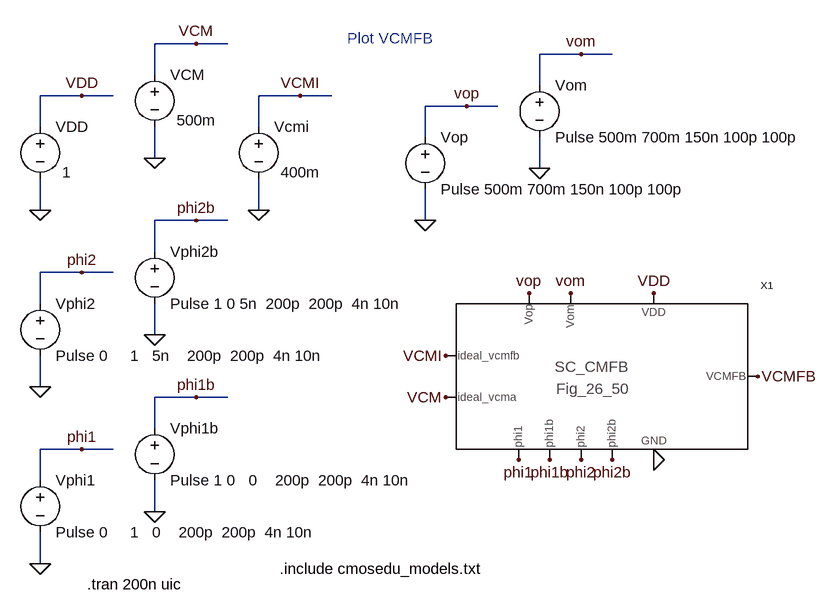
[diagram p0: schematic Fig26_51.asc]
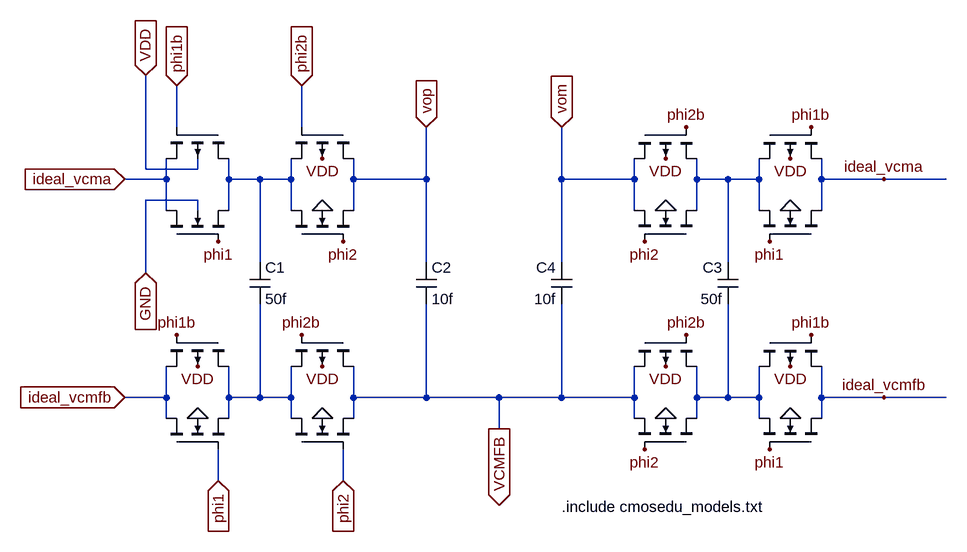
[diagram p1: sub-circuit fig_26_50.asc]
Fig26_51.asc, the LTspice schematic file:
Version 4
SHEET 1 3228 1244
WIRE 1424 -112 1360 -112
WIRE 1472 -112 1424 -112
WIRE 2016 -96 1952 -96
WIRE 2064 -96 2016 -96
WIRE 1360 -64 1360 -112
WIRE 1952 -48 1952 -96
WIRE 1248 -32 1184 -32
WIRE 1296 -32 1248 -32
WIRE 1584 -32 1520 -32
WIRE 1632 -32 1584 -32
WIRE 1840 -16 1776 -16
WIRE 1888 -16 1840 -16
WIRE 1184 16 1184 -32
WIRE 1520 16 1520 -32
WIRE 1776 32 1776 -16
WIRE 1360 64 1360 16
WIRE 1952 80 1952 32
WIRE 1184 144 1184 96
WIRE 1520 144 1520 96
WIRE 1424 160 1360 160
WIRE 1472 160 1424 160
WIRE 1776 160 1776 112
WIRE 1360 208 1360 160
WIRE 1248 240 1184 240
WIRE 1296 240 1248 240
WIRE 1184 288 1184 240
WIRE 1360 336 1360 288
WIRE 1184 416 1184 368
WIRE 1424 432 1360 432
WIRE 1472 432 1424 432
WIRE 1360 480 1360 432
WIRE 1248 512 1184 512
WIRE 1296 512 1248 512
WIRE 1184 560 1184 512
WIRE 1360 608 1360 560
WIRE 1184 688 1184 640
FLAG 1184 688 0
FLAG 1248 512 phi1
FLAG 1360 608 0
FLAG 1424 432 phi1b
FLAG 1184 416 0
FLAG 1248 240 phi2
FLAG 1360 336 0
FLAG 1424 160 phi2b
FLAG 2128 528 0
FLAG 1184 144 0
FLAG 1248 -32 VDD
FLAG 2128 272 VDD
FLAG 2288 400 VCMFB
FLAG 1920 528 phi1
FLAG 1968 528 phi1b
FLAG 2016 528 phi2
FLAG 2064 528 phi2b
FLAG 1360 64 0
FLAG 1424 -112 VCM
FLAG 1808 432 VCM
FLAG 1520 144 0
FLAG 1584 -32 VCMI
FLAG 1808 368 VCMI
FLAG 1776 160 0
FLAG 1840 -16 vop
FLAG 1952 80 0
FLAG 2016 -96 vom
FLAG 1936 272 vop
FLAG 2000 272 vom
SYMBOL voltage 1184 544 R0
SYMATTR InstName Vphi1
SYMATTR Value Pulse 0 	1   0    200p  200p  4n 10n
SYMBOL voltage 1360 464 R0
SYMATTR InstName Vphi1b
SYMATTR Value Pulse 1 0   0    200p  200p  4n 10n
SYMBOL voltage 1184 272 R0
SYMATTR InstName Vphi2
SYMATTR Value Pulse 0 	1   5n    200p  200p  4n 10n
SYMBOL voltage 1360 192 R0
SYMATTR InstName Vphi2b
SYMATTR Value Pulse 1 0 5n  200p  200p  4n 10n
SYMBOL Fig_26_50 1856 480 R0
SYMATTR InstName X1
SYMBOL voltage 1184 0 R0
WINDOW 3 34 86 Left 0
WINDOW 123 0 0 Left 0
WINDOW 39 0 0 Left 0
SYMATTR Value 1
SYMATTR InstName VDD
SYMBOL voltage 1360 -80 R0
WINDOW 3 34 86 Left 0
WINDOW 123 0 0 Left 0
WINDOW 39 0 0 Left 0
SYMATTR Value 500m
SYMATTR InstName VCM
SYMBOL voltage 1520 0 R0
WINDOW 3 34 86 Left 0
WINDOW 123 0 0 Left 0
WINDOW 39 0 0 Left 0
SYMATTR Value 400m
SYMATTR InstName Vcmi
SYMBOL voltage 1776 16 R0
SYMATTR InstName Vop
SYMATTR Value Pulse 500m 700m 150n 100p 100p
SYMBOL voltage 1952 -64 R0
SYMATTR InstName Vom
SYMATTR Value Pulse 500m 700m 150n 100p 100p
TEXT 1256 720 Left 0 !.tran 200n uic
TEXT 1552 696 Left 0 !.include cmosedu_models.txt
TEXT 1656 -120 Left 0 ;Plot VCMFB

fig_26_50.asc, the sub-circuit schematic file:
Version 4
SHEET 1 1620 680
WIRE 432 -304 432 -368
WIRE 624 -304 624 -368
WIRE 384 -240 384 -384
WIRE 464 -240 464 -256
WIRE 464 -240 384 -240
WIRE 416 -224 416 -256
WIRE 416 -224 352 -224
WIRE 512 -224 512 -256
WIRE 560 -224 512 -224
WIRE 608 -224 608 -256
WIRE 608 -224 560 -224
WIRE 704 -224 704 -256
WIRE 816 -224 816 -304
WIRE 816 -224 704 -224
WIRE 1024 -224 1024 -304
WIRE 1136 -224 1136 -256
WIRE 1136 -224 1024 -224
WIRE 1232 -224 1232 -256
WIRE 1280 -224 1232 -224
WIRE 1328 -224 1328 -256
WIRE 1328 -224 1280 -224
WIRE 1424 -224 1424 -256
WIRE 1520 -224 1424 -224
WIRE 1616 -224 1520 -224
WIRE 464 -192 384 -192
WIRE 416 -176 416 -224
WIRE 464 -176 464 -192
WIRE 512 -176 512 -224
WIRE 608 -176 608 -224
WIRE 704 -176 704 -224
WIRE 1136 -176 1136 -224
WIRE 1232 -176 1232 -224
WIRE 1328 -176 1328 -224
WIRE 1424 -176 1424 -224
WIRE 560 -96 560 -224
WIRE 816 -96 816 -224
WIRE 1024 -96 1024 -224
WIRE 1280 -96 1280 -224
WIRE 384 -80 384 -192
WIRE 416 112 416 64
WIRE 416 112 352 112
WIRE 512 112 512 64
WIRE 560 112 560 -32
WIRE 560 112 512 112
WIRE 608 112 608 64
WIRE 608 112 560 112
WIRE 704 112 704 64
WIRE 816 112 816 -32
WIRE 816 112 704 112
WIRE 928 112 816 112
WIRE 1024 112 1024 -32
WIRE 1024 112 928 112
WIRE 1136 112 1136 64
WIRE 1136 112 1024 112
WIRE 1232 112 1232 64
WIRE 1280 112 1280 -32
WIRE 1280 112 1232 112
WIRE 1328 112 1328 64
WIRE 1328 112 1280 112
WIRE 1424 112 1424 64
WIRE 1520 112 1424 112
WIRE 1616 112 1520 112
WIRE 416 144 416 112
WIRE 512 144 512 112
WIRE 608 144 608 112
WIRE 704 144 704 112
WIRE 1136 144 1136 112
WIRE 1232 144 1232 112
WIRE 1328 144 1328 112
WIRE 1424 144 1424 112
WIRE 928 160 928 112
WIRE 496 240 496 192
WIRE 688 240 688 192
FLAG 496 -128 phi1
FLAG 656 -256 VDD
FLAG 656 -176 0
FLAG 688 -128 phi2
FLAG 464 64 VDD
FLAG 464 144 0
FLAG 432 16 phi1b
FLAG 656 64 VDD
FLAG 656 144 0
FLAG 624 16 phi2b
FLAG 1376 -256 VDD
FLAG 1376 -176 0
FLAG 1344 -128 phi1
FLAG 1408 -304 phi1b
FLAG 1184 -256 VDD
FLAG 1184 -176 0
FLAG 1152 -128 phi2
FLAG 1216 -304 phi2b
FLAG 1376 64 VDD
FLAG 1376 144 0
FLAG 1344 192 phi1
FLAG 1408 16 phi1b
FLAG 1184 64 VDD
FLAG 1184 144 0
FLAG 1152 192 phi2
FLAG 1216 16 phi2b
FLAG 1520 -224 ideal_vcma
FLAG 1520 112 ideal_vcmfb
FLAG 352 -224 ideal_vcma
IOPIN 352 -224 In
FLAG 352 112 ideal_vcmfb
IOPIN 352 112 In
FLAG 384 -384 VDD
IOPIN 384 -384 In
FLAG 384 -80 GND
IOPIN 384 -80 In
FLAG 928 160 VCMFB
IOPIN 928 160 Out
FLAG 816 -304 vop
IOPIN 816 -304 In
FLAG 1024 -304 vom
IOPIN 1024 -304 In
FLAG 432 -368 phi1b
IOPIN 432 -368 In
FLAG 496 240 phi1
IOPIN 496 240 In
FLAG 624 -368 phi2b
IOPIN 624 -368 In
FLAG 688 240 phi2
IOPIN 688 240 In
SYMBOL nmos4 416 -128 R270
WINDOW 0 119 20 Invisible 0
WINDOW 3 157 46 Invisible 0
SYMATTR InstName M1
SYMATTR Value N_50n
SYMATTR Value2 l=50n w=500n
SYMBOL pmos4 512 -304 R90
WINDOW 0 116 21 Invisible 0
WINDOW 3 175 48 Invisible 0
SYMATTR InstName M2
SYMATTR Value P_50n
SYMATTR Value2 l=50n w=500n
SYMBOL nmos4 608 -128 R270
WINDOW 0 119 20 Invisible 0
WINDOW 3 157 46 Invisible 0
SYMATTR InstName M3
SYMATTR Value N_50n
SYMATTR Value2 l=50n w=500n
SYMBOL pmos4 704 -304 R90
WINDOW 0 116 21 Invisible 0
WINDOW 3 175 48 Invisible 0
SYMATTR InstName M4
SYMATTR Value P_50n
SYMATTR Value2 l=50n w=500n
SYMBOL nmos4 416 192 R270
WINDOW 0 119 20 Invisible 0
WINDOW 3 157 46 Invisible 0
SYMATTR InstName M5
SYMATTR Value N_50n
SYMATTR Value2 l=50n w=500n
SYMBOL pmos4 512 16 R90
WINDOW 0 116 21 Invisible 0
WINDOW 3 175 48 Invisible 0
SYMATTR InstName M6
SYMATTR Value P_50n
SYMATTR Value2 l=50n w=500n
SYMBOL nmos4 608 192 R270
WINDOW 0 119 20 Invisible 0
WINDOW 3 157 46 Invisible 0
SYMATTR InstName M7
SYMATTR Value N_50n
SYMATTR Value2 l=50n w=500n
SYMBOL pmos4 704 16 R90
WINDOW 0 116 21 Invisible 0
WINDOW 3 175 48 Invisible 0
SYMATTR InstName M8
SYMATTR Value P_50n
SYMATTR Value2 l=50n w=500n
SYMBOL cap 544 -96 R0
SYMATTR InstName C1
SYMATTR Value 50f
SYMBOL cap 800 -96 R0
SYMATTR InstName C2
SYMATTR Value 10f
SYMBOL nmos4 1424 -128 M270
WINDOW 0 119 20 Invisible 0
WINDOW 3 157 46 Invisible 0
SYMATTR InstName M9
SYMATTR Value N_50n
SYMATTR Value2 l=50n w=500n
SYMBOL pmos4 1328 -304 M90
WINDOW 0 116 21 Invisible 0
WINDOW 3 175 48 Invisible 0
SYMATTR InstName M10
SYMATTR Value P_50n
SYMATTR Value2 l=50n w=500n
SYMBOL nmos4 1232 -128 M270
WINDOW 0 119 20 Invisible 0
WINDOW 3 157 46 Invisible 0
SYMATTR InstName M11
SYMATTR Value N_50n
SYMATTR Value2 l=50n w=500n
SYMBOL pmos4 1136 -304 M90
WINDOW 0 116 21 Invisible 0
WINDOW 3 175 48 Invisible 0
SYMATTR InstName M12
SYMATTR Value P_50n
SYMATTR Value2 l=50n w=500n
SYMBOL nmos4 1424 192 M270
WINDOW 0 119 20 Invisible 0
WINDOW 3 157 46 Invisible 0
SYMATTR InstName M13
SYMATTR Value N_50n
SYMATTR Value2 l=50n w=500n
SYMBOL pmos4 1328 16 M90
WINDOW 0 116 21 Invisible 0
WINDOW 3 175 48 Invisible 0
SYMATTR InstName M14
SYMATTR Value P_50n
SYMATTR Value2 l=50n w=500n
SYMBOL nmos4 1232 192 M270
WINDOW 0 119 20 Invisible 0
WINDOW 3 157 46 Invisible 0
SYMATTR InstName M15
SYMATTR Value N_50n
SYMATTR Value2 l=50n w=500n
SYMBOL pmos4 1136 16 M90
WINDOW 0 116 21 Invisible 0
WINDOW 3 175 48 Invisible 0
SYMATTR InstName M16
SYMATTR Value P_50n
SYMATTR Value2 l=50n w=500n
SYMBOL cap 1296 -96 M0
SYMATTR InstName C3
SYMATTR Value 50f
SYMBOL cap 1040 -96 M0
SYMATTR InstName C4
SYMATTR Value 10f
TEXT 1024 280 Left 0 !.include cmosedu_models.txt

The netlist it stands for:
* Fig26_51.asc
Vphi1 phi1 0 Pulse 0 	1   0    200p  200p  4n 10n
Vphi1b phi1b 0 Pulse 1 0   0    200p  200p  4n 10n
Vphi2 phi2 0 Pulse 0 	1   5n    200p  200p  4n 10n
Vphi2b phi2b 0 Pulse 1 0 5n  200p  200p  4n 10n
XX1 VCMI VCM vop vom phi1 phi1b phi2 phi2b VCMFB VDD 0 fig_26_50
VDD VDD 0 1
VCM VCM 0 500m
Vcmi VCMI 0 400m
Vop vop 0 Pulse 500m 700m 150n 100p 100p
Vom vom 0 Pulse 500m 700m 150n 100p 100p

* block symbol definitions
.subckt fig_26_50 ideal_vcmfb ideal_vcma Vop Vom phi1 phi1b phi2 phi2b VCMFB VDD GND
M1 ideal_vcma phi1 N001 GND N_50n l=50n w=500n
M2 N001 phi1b ideal_vcma VDD P_50n l=50n w=500n
M3 N001 phi2 vop 0 N_50n l=50n w=500n
M4 vop phi2b N001 VDD P_50n l=50n w=500n
M5 ideal_vcmfb phi1 N003 0 N_50n l=50n w=500n
M6 N003 phi1b ideal_vcmfb VDD P_50n l=50n w=500n
M7 N003 phi2 VCMFB 0 N_50n l=50n w=500n
M8 VCMFB phi2b N003 VDD P_50n l=50n w=500n
C1 N001 N003 50f
C2 vop VCMFB 10f
M9 ideal_vcma phi1 N002 0 N_50n l=50n w=500n
M10 N002 phi1b ideal_vcma VDD P_50n l=50n w=500n
M11 N002 phi2 vom 0 N_50n l=50n w=500n
M12 vom phi2b N002 VDD P_50n l=50n w=500n
M13 ideal_vcmfb phi1 N004 0 N_50n l=50n w=500n
M14 N004 phi1b ideal_vcmfb VDD P_50n l=50n w=500n
M15 N004 phi2 VCMFB 0 N_50n l=50n w=500n
M16 VCMFB phi2b N004 VDD P_50n l=50n w=500n
C3 N002 N004 50f
C4 vom VCMFB 10f
.include cmosedu_models.txt
.ends fig_26_50

.model NMOS NMOS
.model PMOS PMOS
.lib standard.mos
.tran 200n uic
.include cmosedu_models.txt
* Plot VCMFB
.backanno
.end